# Altium project vehicle electronics.PrjPcb
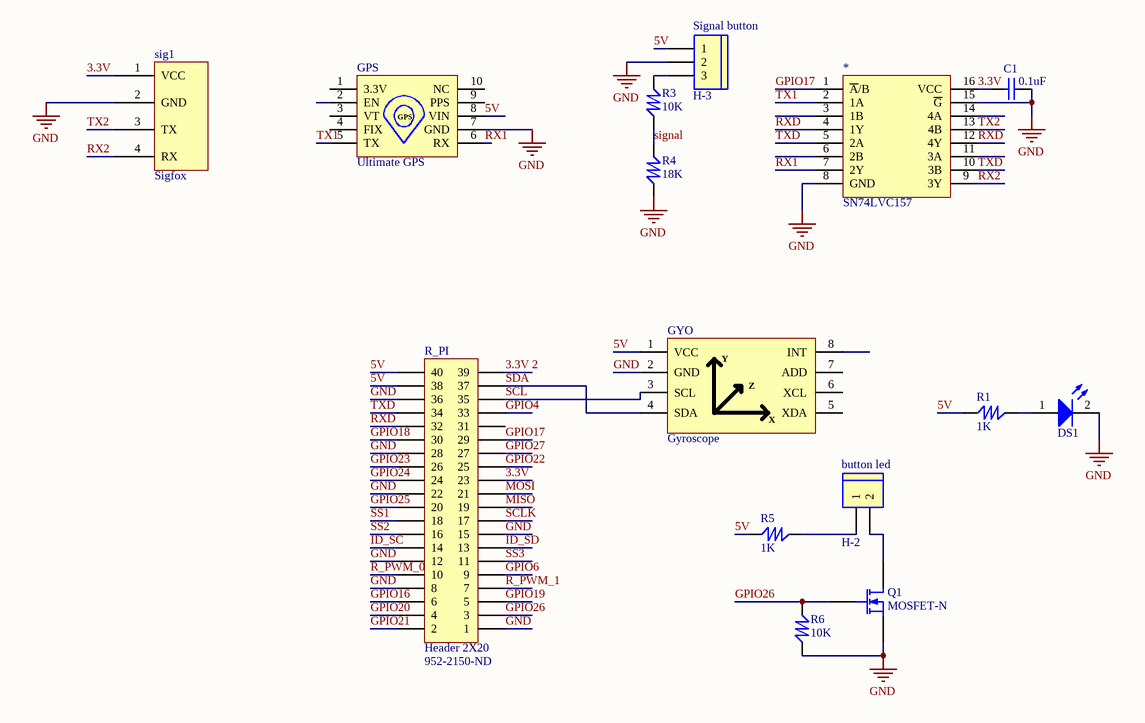
[diagram p0: vehicle electronics.SchDoc]
1 sheet, 15 parts. Net scope: global (net labels, ports and power ports of the same name join across sheets).
Board file: vehicle electronics.PcbDoc

## Sheet vehicle electronics.SchDoc
size A4

### Parts
*  SN74LVC157  [SOIC-16]
button_led  H-2  [2PIN-5.08A]
C1  value 0.1uF  [C0805]  (hidden comment: CAP_sop)
DS1  LED_SOP  [LED0805G]  (value not drawn)
GPS  Ultimate GPS  [GPS]
GYO  Gyroscope  [gryoscope]
Q1  MOSFET-N  [SOT-23]
R1  1K  [R0805]
R3  10K  [R0805]
R4  18K  [R0805]
R5  1K  [R0805]
R6  10K  [R0805]
R_PI  Header 2X20  Supplier Part Number 1: 952-2150-ND  [HDR2-20]
sig1  Sigfox  [Sigfox]
Signal_button  H-3  [3PIN-5.08A]

### Nets
GND: *.8(GND) *.15(~{G}) C1.1 DS1.2(K) GPS.7(GND) GYO.2(GND) Q1.3(S) R4.1 R6.1 R_PI.1 R_PI.8 R_PI.12 R_PI.15 R_PI.22 R_PI.28 R_PI.36 sig1.2(GND) Signal_button.2
3.3V: *.16(VCC) C1.2 R_PI.23 sig1.1(VCC)
3.3V 2: R_PI.39
5V: GPS.8(VIN) GYO.1(VCC) R1.1 R5.1 R_PI.38 R_PI.40 Signal_button.1
GPIO4: R_PI.33
GPIO6: R_PI.9
GPIO16: R_PI.6
GPIO17: *.1(~{A}/B) R_PI.29
GPIO18: R_PI.30
GPIO19: R_PI.5
GPIO20: R_PI.4
GPIO21: R_PI.2
GPIO22: R_PI.25
GPIO23: R_PI.26
GPIO24: R_PI.24
GPIO25: R_PI.20
GPIO26: Q1.1(G) R6.2 R_PI.3
GPIO27: R_PI.27
ID_SC: R_PI.14
ID_SD: R_PI.13
MISO: R_PI.19
MOSI: R_PI.21
R_PWM_0: R_PI.10
R_PWM_1: R_PI.7
RX1: *.7(2Y) GPS.6(RX)
RX2: *.9(3Y) sig1.4(RX)
RXD: *.4(1Y) *.12(4Y) R_PI.32
SCL: GYO.3(SCL) R_PI.35
SCLK: R_PI.17
SDA: GYO.4(SDA) R_PI.37
signal: R3.1 R4.2
SS1: R_PI.18
SS2: R_PI.16
SS3: R_PI.11
TX1: *.2(1A) GPS.5(TX)
TX2: *.13(4B) sig1.3(TX)
TXD: *.5(2A) *.10(3B) R_PI.34
Netbutton_led_1: button_led.1 R5.2
Netbutton_led_2: button_led.2 Q1.2(D)
NetDS1_1: DS1.1(A) R1.2
NetR3_2: R3.2 Signal_button.3

Not connected (* = marked no-connect by the designer): * 3(1B) 6(2B) 11(3A) 14(4A); GPS 1(3.3V) 2(EN) 3(VT) 4(FIX) 9(PPS) 10(NC); GYO 5(XDA) 6(XCL) 7(ADD) 8(INT); R_PI 31

### Notes on the sheet
- (in symbol Gyroscope) Y; Z; X

### Library data of the parts
button_led = H-2: Header, 2-Pin; Manufacturer: Generic Components; Class: Connector
C1 = CAP_sop: capacitance; Manufacturer: Generic Components; Class: Passive; SubClass: Capacitor; Published: 08/06/2000; Publisher: Altium Hobart Technology Centre
DS1 = LED_SOP: Manufacturer: Generic Components; Class: Optoelectronic; SubClass: LED; Published: 08/06/2012; Publisher: Altium Hobart Technology Centre
Q1 = MOSFET-N: N-Channel MOSFET; Manufacturer: Generic Components; Class: Discrete; SubClass: MOSFET - Low Power; Published: 08/06/2000; Publisher: Altium Hobart Technology Centre
R1 R3-R6 = res_sop
R_PI = Header 2X20: Header, 20Pin, Dual row; Manufacturer: Generic Components; Class: Connector; Supplier 1: Digi-Key
Signal_button = H-3: Header, 3-Pin; Manufacturer: Generic Components; Class: Connector